# Altium schematic sheet Filters.SchDoc
size A4; SheetNumber: 2; SheetTotal: 2
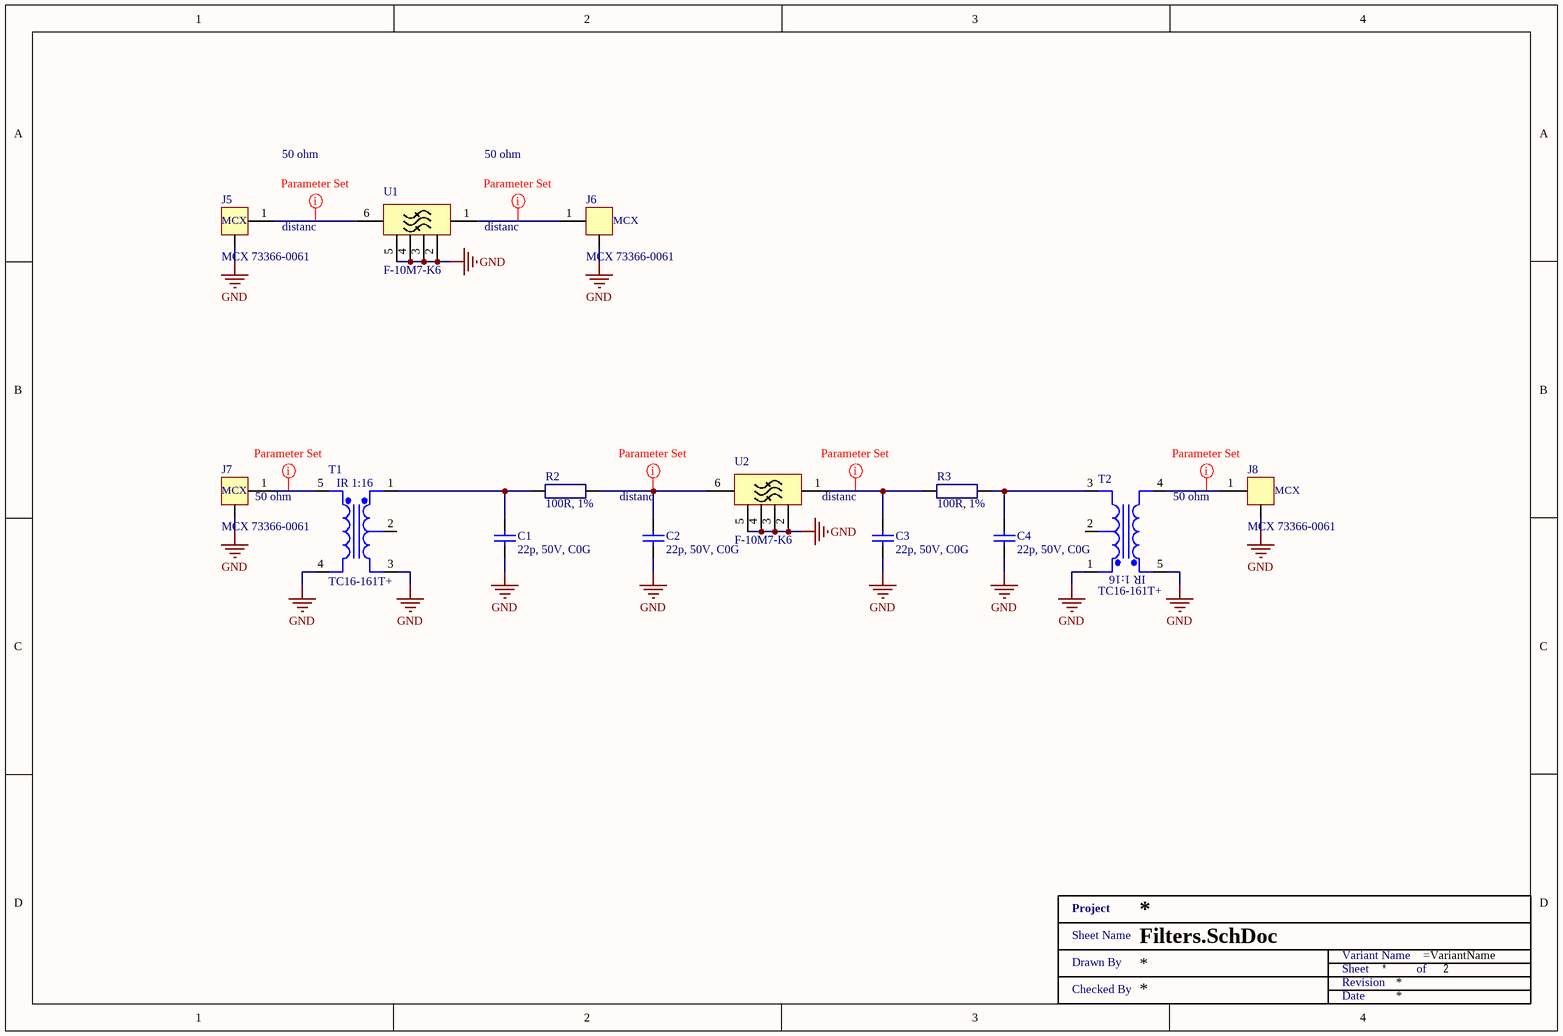
[diagram p0: Filters.SchDoc]

## Parts
C1  22p, 50V, C0G  [SMD0603]
C2  22p, 50V, C0G  [SMD0603]
C3  22p, 50V, C0G  [SMD0603]
C4  22p, 50V, C0G  [SMD0603]
J5  MCX 73366-0061  [73366-0061]
J6  MCX 73366-0061  [73366-0061]
J7  MCX 73366-0061  [73366-0061]
J8  MCX 73366-0061  [73366-0061]
R2  100R, 1%  [SMD0603 - R]
R3  100R, 1%  [SMD0603 - R]
T1  TC16-161T+  [MABA-007159-000000]
T2  TC16-161T+  [MABA-007159-000000]
U1  F-10M7-K6  [F-10M7-K6]
U2  F-10M7-K6  [F-10M7-K6]
XX?  Title 1  (value not drawn)  (graphical)

## Nets
GND: C1.1 C2.1 C3.1 C4.1 J5.2(GND) J6.2(GND) J7.2(GND) J8.2(GND) T1.3(Secondary) T1.4(Primary) T2.1(Secondary_Dot) T2.5(Primary_Dot) U1.2(GND) U1.3(GND) U1.4(GND) U1.5(GND) U2.2(GND) U2.3(GND) U2.4(GND) U2.5(GND)
NetC1_2: C1.2 R2.1 T1.1(Secondary_Dot)
NetC2_2: C2.2 R2.2 U2.6(OUT)
NetC3_2: C3.2 R3.1 U2.1(IN)
NetC4_2: C4.2 R3.2 T2.3(Secondary)
NetJ5_1: J5.1(INPUT) U1.6(OUT)
NetJ6_1: J6.1(INPUT) U1.1(IN)
NetJ7_1: J7.1(INPUT) T1.5(Primary_Dot)
NetJ8_1: J8.1(INPUT) T2.4(Primary)

Not connected (* = marked no-connect by the designer): T1 2(Secondary_CT); T2 2(Secondary_CT)

## Layout directives
net class 50 ohm; net class distanc: NetJ5_1, NetJ6_1
net class 50 ohm: NetJ7_1, NetJ8_1
net class distanc: NetC2_2, NetC3_2

## Notes on the sheet
- (in symbol TC16-161T+) IR 1:16
- (in symbol Title 1) Project; Sheet Name; Variant Name; Drawn By; Sheet; of; Revision; Checked By; Date

## Library data of the parts
C1-C4 = MC0603N220J500CT: MULTICOMP - MC0603N220J500CT - CAP, MLCC, C0G/NP0, 22PF, 50V, 0603; Manufacturer: MULTICOMP; Manufacturer Part Number: MC0603N220J500CT; RoHS: YES; Stock 1: 184439; Pricing 1: 10=0.0077, 100=0.0065, 500=0.0052, 1000=0.0044, 2000=0.0038 (GBP); ComponentLink1URL: http://www.farnell.com/datasheets/1901289.pdf; ComponentLink1Description: http://www.farnell.com/datasheets/1901289.pdf; Capacitance: 22p; Supplier 1: Farnell; Supplier Part Number 1: 1759057; Supplier 2: Newark; Supplier Part Number 2: 94W8766
J5-J8 = 73366-0061: CONN MCX JACK STR 50 OHM PCB; Manufacturer: Molex, LLC; Manufacturer Part Number: 0733660061; Connector Type: Jack, Female Socket; Contact Termination: Solder; Impedance: 50 Ohm; Body Material: Brass; Body Finish: Gold; Dielectric Material: Polytetrafluoroethylene (PTFE); Center Contact Material: Beryllium Copper; Mating Cycles: 500; RoHS: RoHS Compliant; Category: Connectors, Interconnects; Stock 1: 39394; Pricing 1: 1=1.95, 10=1.765, 25=1.6572, 50=1.5854, 100=1.5133, 250=1.36916, 500=1.26106, 1000=1.0809, 2500=1.00884 (USD); Packaging: Tray; Part Status: Active; Connector Style: MCX; Shield Termination: Solder; Mounting Type: Through Hole; Mounting Feature: -; Cable Group: -; Fastening Type: Snap-On; Features: -; Housing Color: Gold; Ingress Protection: -; Includes: -; Center Contact Plating: Gold; Operating Temperature: -55°C ~ 155°C; Insertion Loss: -; ComponentLink1URL: https://www.molex.com/pdm_docs/sd/733660061_sd.pdf; ComponentLink1Description: https://www.molex.com/pdm_docs/sd/733660061_sd.pdf; Supplier 1: Mouser; Supplier Part Number 1: 538-73366-0061; Supplier 2: Digi-Key; Supplier Part Number 2: WM5541-ND; Supplier 3: Farnell; Supplier Part Number 3: 1909245
R2 R3 = MCWR06X1000FTL: MULTICOMP - MCWR06X1000FTL - RES, THICK FILM, 100R, 1%, 0.1W, 0603; Voltage Rating: 50; Resistor Case Style: 0603 [1608 Metric]; Power Rating: 100; Product Range: MCWR Series; Temperature Coefficient: ± 100; SVHC: No SVHC (07-Jul-2017)<!--FANDB--><div class="features-and-benefits-container"><div class="features-and-benefits-desc-container"><span class="features-and-benefits-container-desc">SMD Chip Resistor, Thick Film, 100 ohm, 50 V, 0603 [1608 Metric], 100 mW, ± 1%, MCWR Series</span></div><div class="features-and-benefits-description"><span class="features-benefits-value">The MCWR06X1000FTL is a thick film Chip Resistor with 0603 chip format. The resistor is constructed in a high grade ceramic body (aluminium oxide). Internal metal electrodes are added at each end and connected by a resistive paste that is applied to the top surface of the substrate. The composition of the paste is adjusted to give the approximate resistance required and the value is trimmed to within tolerance by laser cutting of this resistive layer.</span></div><div class="features-and-benefits-list"><ul class="features-and-benefits-list-list"><li class="features-and-benefits-list-item">High reliability and stability</li><li class="features-and-benefits-list-item">Reduced size of final equipment</li><li class="features-and-benefits-list-item">Lower assembly costs</li><li class="features-and-benefits-list-item">Higher component and equipment reliability</li></ul></div><div class="features-and-benefits-applications"><ul class="features-and-benefits-value"><li class="features-and-benefits-list-item">Consumer Electronics</li><li class="features-and-benefits-list-item">Computers & Computer Peripherals</li><li class="features-and-benefits-list-item">Communications & Networking</li></ul></div></div>; Supplier 1: Farnell; Supplier Part Number 1: 2447227; Manufacturer: MULTICOMP; Manufacturer Part Number: MCWR06X1000FTL; RoHS: Y-EX; Stock 1: 246691; Pricing 1: 10=0.0032, 100=0.002, 500=0.0013, 1000=0.0011, 2500=0.0009 (GBP); Resistance: 100R; Resistance Tolerance: ± 1%; Packaging: Cut Tape; Resistor Element Material: Thick Film; Automotive Qualification Standard: -; ComponentLink1URL: http://www.farnell.com/datasheets/1849611.pdf; ComponentLink1Description: http://www.farnell.com/datasheets/1849611.pdf
T1 T2 = TC16-161T+: RF Transformer, 50 ohm, 16.0: 1, 0.60-160 MHz, SMT; Manufacturer: Mini-Circuits; Supplier 1: Mouser; Supplier Part Number 1: 139-TC16-161T; Manufacturer Part Number: TC16-161T+; RoHS: Yes; Stock 1: 1094; Pricing 1: 1=3.45000, 10=2.88000, 50=2.88000, 100=2.36000, 250=1.96000, 500=1.84000, 1000=1.73000, 2000=1.64000, 4000=1.52000, 10000=1.49000 (USD); RoHS Compliant: Yes; Supplier 2: Digi-Key; Supplier Part Number 2: 3157-TC16-161T+CT-ND
U1 U2 = F-10M7-K6: 10.7 MHz crystal band-pass filter, 8 poles / - Bandwidth (-3dB): 12 KHz / - Selectivity: 90 dB / - Impedance: 900 Ω / - Dimensions: 38 x 18 mm, h 12 mm